# EAGLE design Tueroeffner (EAGLE 7.4.0)
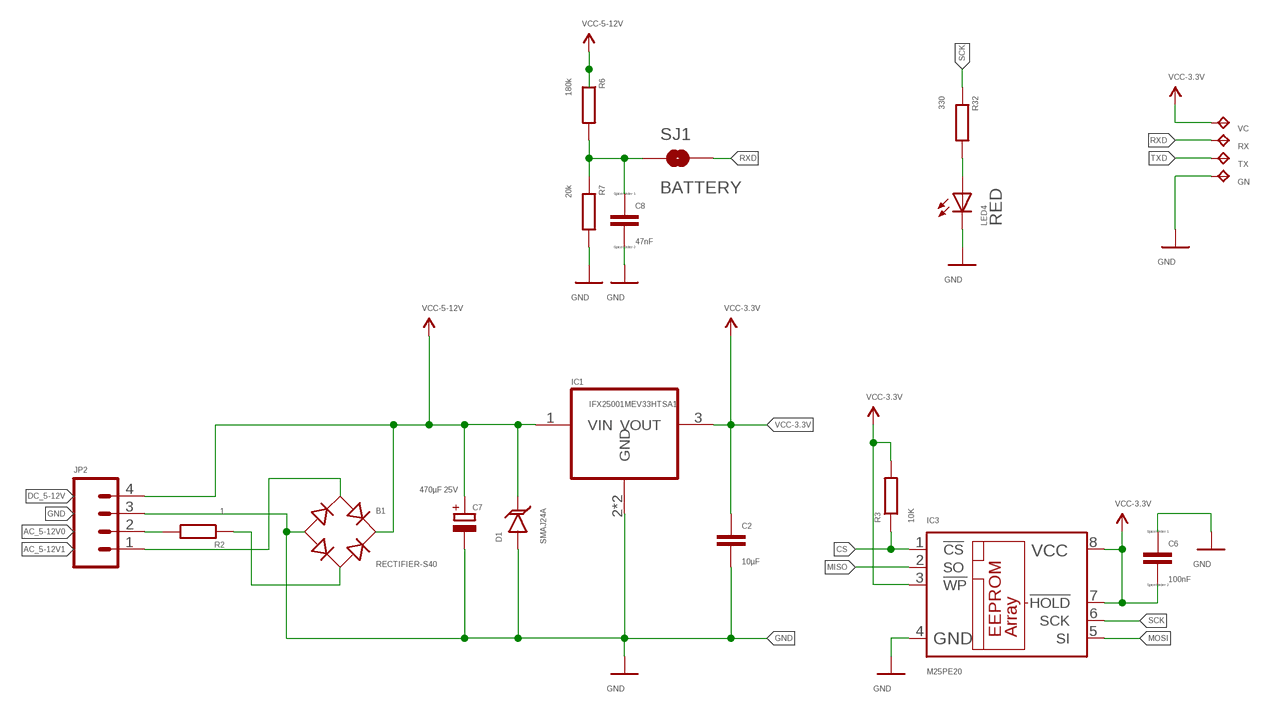
[diagram p0: schematic, sheet 1, part 1 of 2]
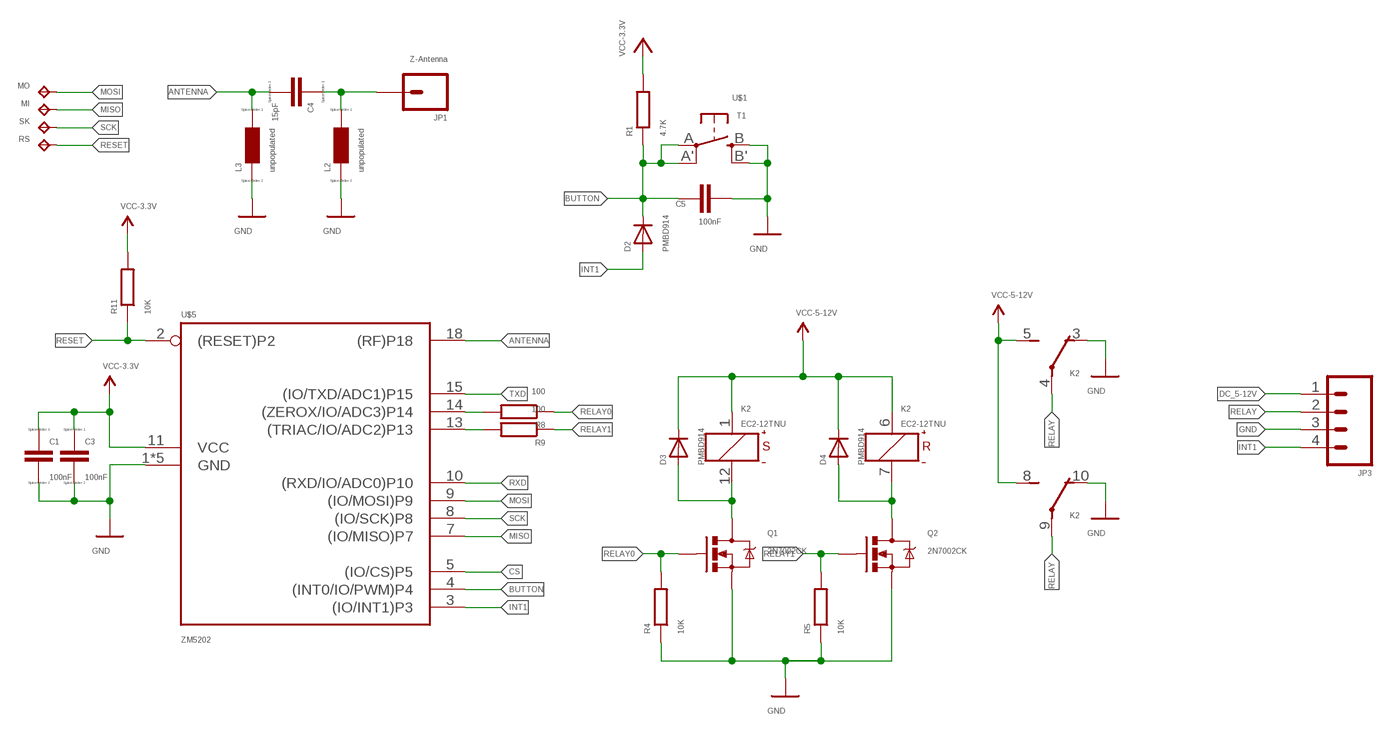
[diagram p1: schematic, sheet 1, part 2 of 2]

## Parts
B1  RECTIFIER-S40  [TO-269AA]
C1  100nF  CC2012  [C2012]
C2  10µF  C-EUC0805  [C0805]
C3  100nF  CC2012  [C2012]
C4  15pF  CC2012  [C2012]
C5  100nF  C-EUC0805  [C0805]
C6  100nF  CC2012  [C2012]
C7  470µF 25V  CPOL-EU175TMP-0810  [175TMP-0810]
C8  47nF  CC2012  [C2012]
D1  SMAJ24A  TVSSMA  [SMA-DIODE]
D2  PMBD914  D-A1-C3  [SOT23]
D3  PMBD914  D-A1-C3  [SOT23]
D4  PMBD914  D-A1-C3  [SOT23]
GN  TPTP14R  [TP14R]
IC1  IFX25001MEV33HTSA1  REG1118  [SOT223]
IC3  M25PE20  25LC080SN  [SO-08]
JP1  Z-Antenna  M01PTH  [1X01]
JP2  M04SCREW  [SCREWTERMINAL-3.5MM-4]
JP3  M04SCREW  [SCREWTERMINAL-3.5MM-4]
K2  EC2-12TNU  TX2-L2-12V  [TX2-L2]
L2  unpopulated  LL2012C  [L2012C]
L3  unpopulated  LL2012C  [L2012C]
LED4  RED  LEDCHIP-LED0805  [CHIP-LED0805]
MI  TPTP14R  [TP14R]
MO  TPTP14R  [TP14R]
Q1  2N7002CK  MOSFET-NCHANNELBSS138  [SOT23-3]
Q2  2N7002CK  MOSFET-NCHANNELBSS138  [SOT23-3]
R1  4.7K  R-EU_M0805  [M0805]
R2  1  R-EU_M2012  [M2012]
R3  10K  R-EU_M2012  [M2012]
R4  10K  R-EU_M2012  [M2012]
R5  10K  R-EU_M2012  [M2012]
R6  180k  R-EU_M2012  [M2012]
R7  20k  R-EU_M2012  [M2012]
R8  100  R-EU_M2012  [M2012]
R9  100  R-EU_M2012  [M2012]
R11  10K  R-EU_M2012  [M2012]
R32  330  R-EU_M2012  [M2012]
RS  TPTP14R  [TP14R]
RX  TPTP14R  [TP14R]
SJ1  BATTERY  SOLDERJUMPERTRACE  [SJ_2S-TRACE]
SK  TPTP14R  [TP14R]
TX  TPTP14R  [TP14R]
U$1  T1  EVQQ2  [EVQ-Q2]
U$5  ZM5202  ZM5202ZM5202_STERN  [ZM5202_STERN]
VC  TPTP14R  [TP14R]

## Nets
AC_5-12V0: JP2.2 R2.2
AC_5-12V1: B1.AC1 JP2.1
ANTENNA: C4.2 L3.1 U$5.18((RF)P18)
BUTTON: C5.1 D2.3(C) R1.1 U$1.A'(P1) U$1.A(P) U$5.4((INT0/IO/PWM)P4)
CS: IC3.1(!CS) R3.1 U$5.5((IO/CS)P5)
DC_5-12V: B1.+ C7.+ D1.C D3.3(C) D4.3(C) IC1.1(VIN) JP2.4 JP3.1 K2.1(S:+) K2.5(1:S) K2.6(R:+) K2.8(2:S) R6.1 ; supply symbol labelled VCC-5-12V
GND: B1.- C1.2 C2.2 C3.2 C5.2 C6.1 C7.- C8.2 D1.A GN.TP IC1.2(GND) IC1.4(GND) IC3.4(GND) JP2.3 JP3.3 K2.3(1:O) K2.10(2:O) L2.2 L3.2 LED4.C Q1.2(S) Q2.2(S) R4.1 R5.1 R7.2 U$1.B'(S1) U$1.B(S) U$5.1(GND) U$5.6(GND) U$5.12(GND) U$5.16(GND) U$5.17(GND)
INT1: D2.1(A) JP3.4 U$5.3((IO/INT1)P3)
MISO: IC3.2(SO) MI.TP U$5.7((IO/MISO)P7)
MOSI: IC3.5(SI) MO.TP U$5.9((IO/MOSI)P9)
N$1: B1.AC2 R2.1
N$2: C8.1 R6.2 R7.1 SJ1.1
N$4: R8.2 U$5.14((ZEROX/IO/ADC3)P14)
N$5: R9.2 U$5.13((TRIAC/IO/ADC2)P13)
N$6: D3.1(A) K2.12(S:-) Q1.3(D)
N$7: D4.1(A) K2.7(R:-) Q2.3(D)
N$28: LED4.A R32.2
N$33: C4.1 JP1.1 L2.1
RELAY: JP3.2 K2.4(1:P) K2.9(2:P)
RELAY0: Q1.1(G) R4.2 R8.1
RELAY1: Q2.1(G) R5.2 R9.1
RESET: R11.1 RS.TP U$5.2((RESET)P2)
RXD: RX.TP SJ1.2 U$5.10((RXD/IO/ADC0)P10)
SCK: IC3.6(SCK) R32.1 SK.TP U$5.8((IO/SCK)P8)
TXD: TX.TP U$5.15((IO/TXD/ADC1)P15)
VCC-3.3V: C1.1 C2.1 C3.1 C6.2 IC1.3(VOUT) IC3.3(!WP) IC3.7(!HOLD) IC3.8(VCC) R1.2 R3.2 R11.2 U$5.11(VCC) VC.TP

## Library data of the parts
B1 = rectifier:RECTIFIER-: Rectifier
C1 C3 C4 C6 C8 = eagle-ltspice:C: CAPACITOR, European symbol; SPICEMODEL: NONE; SPICEPREFIX: C
C2 C5 = rcl:C-EU: CAPACITOR, European symbol
C7 = rcl:CPOL-EU: POLARIZED CAPACITOR, European symbol
D1 = SparkFun-DiscreteSemi:TVS: Transient voltage suppressor- prevents ESD on inputs.
D2-D4 = semicon-smd-ipc:D-: DIODE unfilled
GN MI MO RS RX SK TX VC = testpad:TP: Test pad
IC1 = burr-brown:REG1118: 800mA Low Dropout (LDO) Positive Regulator with Current Source and Sink Capability; MPN: REG1118-2.85/2K5G4; OC_FARNELL: unknown; OC_NEWARK: 14M2185
IC3 = 25LC320A:25*: Serial EEPROM 4K/ 8K , SPI bus; MPN: 25LC320A
JP1 = SparkFun-Connectors:M01: Header 1 Standard 1-pin 0.1" header. Use with straight break away headers (SKU : PRT-00116), right angle break away headers (PRT-00553), swiss pins (PRT-00743), machine pins (PRT-00117), and female headers (PRT-00115).
JP2 JP3 = SparkFun-Connectors:M04: Header 4 Standard 4-pin 0.1" header. Use with straight break away headers (SKU : PRT-00116), right angle break away headers (PRT-00553), swiss pins (PRT-00743), machine pins (PRT-00117), and female headers (PRT-00115). Molex polarized connector foot print use with SKU : PRT-08231 with associated crimp pins and housings. 1MM SMD Version SKU: PRT-10208
K2 = relay:TX2?-L2-*: TX Relay 2 coil latching NAiS 2 AMP. HIGH CAPACITY RELAY WITH HIGH SURGE VOLTAGE & HIGH BREAKDOWN VOLTAGE Source: http://www.mew-europe.com/.. en_ds_61022_0001.pdf TX-S SMALL POLARIZED WITH HIGH SENSITIVITY 50mW Source: http://www.mew-europe.com/.. en_ds_61022_0022.pdf; MF: AROMAT/ MATSUSHITA; MPN: TX2-L2-12V; OC_FARNELL: 1124060; OC_NEWARK: 64K3213
L2 L3 = eagle-ltspice:L: INDUCTOR, European symbol; SPICEMODEL: NONE; SPICEPREFIX: L
LED4 = adafruit:LED: LED OSRAM: - CHIPLED LG R971, LG N971, LY N971, LG Q971, LY Q971, LO R971, LY R971 LH N974, LH R974 LS Q976, LO Q976, LY Q976 LO Q996 - Hyper CHIPLED LW Q18S LB Q993, LB Q99A, LB R99A - SideLED LS A670, LO A670, LY A670, LG A670, LP A670 LB A673, LV A673, LT A673, LW A673 LH A674 LY A675 LS A676, LA A676, LO A676, LY A676, LW A676 LS A679, LY A679, LG A679 - Hyper Micro SIDELED® LS Y876, LA Y876, LO Y876, LY Y876 LT Y87S - SmartLED LW L88C, LW L88S LB L89C, LB L89S, LG L890 LS L89K, LO L89K, LY L89K LS L896, LA L896, LO L896, LY L896 - TOPLED LS T670, LO T670, LY T670, LG T670, LP T670 LSG T670, LSP T670, LSY T670, LOP T670, LYG T670 LG T671, LOG T671, LSG T671 LB T673, LV T673, LT T673, LW T673 LH T674 LS T676, LA T676, LO T676, LY T676, LB T676, LH T676, LSB T676, LW T676 LB T67C, LV T67C, LT T67C, LS T67K, LO T67K, LY T67K, LW E67C LS E67B, LA E67B, LO E67B, LY E67B, LB E67C, LV E67C, LT E67C LW T67C LS T679, LY T679, LG T679 LS T770, LO T770, LY T770, LG T770, LP T770 LB T773, LV T773, LT T773, LW T773 LH T774 LS E675, LA E675, LY E675, LS T675 LS T776, LA T776, LO T776, LY T776, LB T776 LHGB T686 LT T68C, LB T68C - Hyper Mini TOPLED® LB M676 - Mini TOPLED Santana® LG M470 LS M47K, LO M47K, LY M47K Source: http://www.osram.convergy.de/
Q1 Q2 = SparkFun-DiscreteSemi:MOSFET-NCHANNEL: Common NMOSFET Parts MFG P/N Store ID Prod ID FDD8780 TRANS-09984 SI7820DN TRANS-11055 FDS6630A IC-08089 2N7002PW TRANS-11151 FQP30N06L COM-10213 TRANS-10060 BSS123LT1G TRANS-08345 BSS138 TRANS-00830 BS170 2N7000; PROD_ID: TRANS-00830; VALUE: 200mA/50V
R1 = rcl:R-EU_: RESISTOR, European symbol
R2-R9 R11 R32 = resistor:R-EU_: RESISTOR, European symbol
SJ1 = SparkFun:SOLDERJUMPER: Solder Jumper Standard SMD solder jumper. Used to automate production. Two varients : Normally Open and Normally Closed are the same, but have different paste layers. NC will have a large amount of paste and should jumper during reflow.
U$1 = adafruit:EVQQ2: SMT 6mm switch, EVQQ2 series http://www.ladyada.net/library/eagle
U$5 = ZM5202:ZM5202: ZM5202 Z-Wave RF-Module

## Board
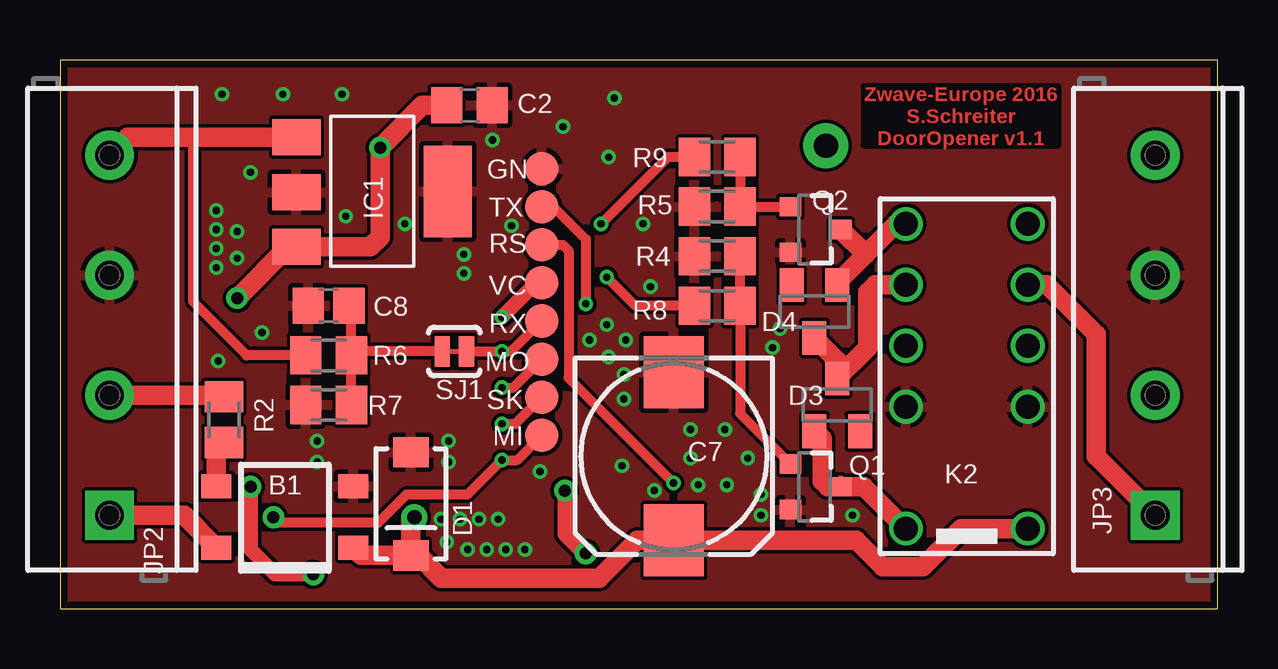
[diagram p2: board, top side]
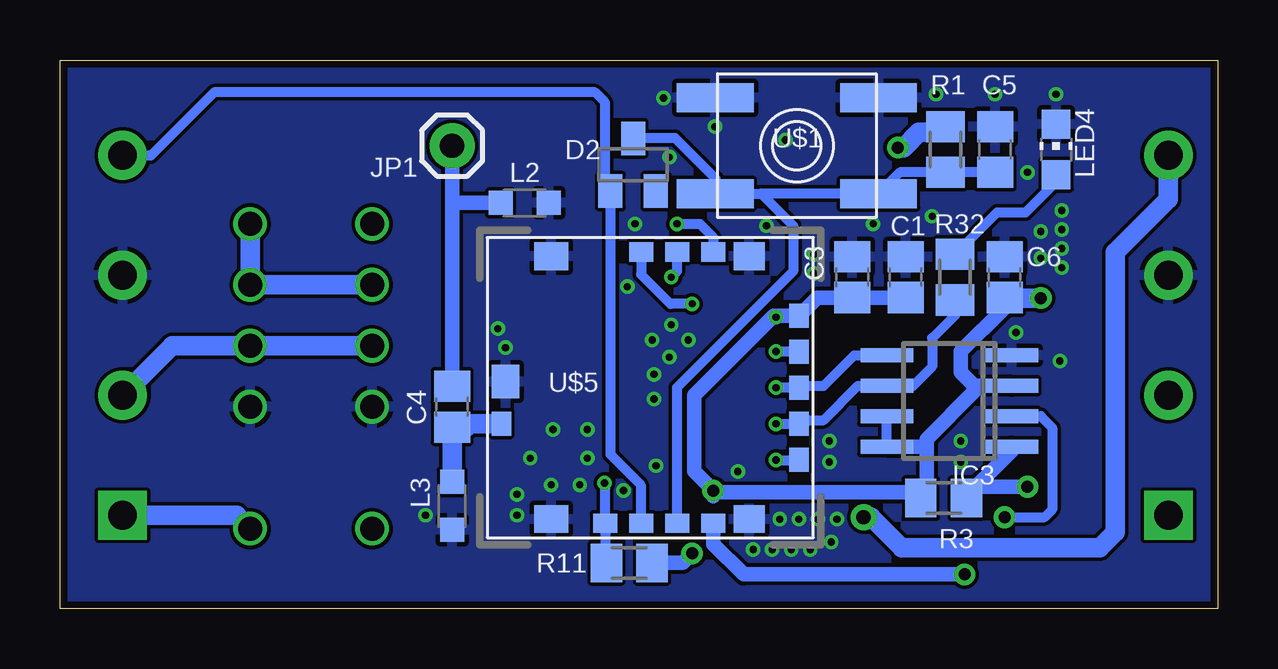
[diagram p3: board, bottom side, seen from below]

Size 48.25 x 22.86 mm. Coordinates in mm from the lower left corner, seen from the top.
Outline: 48.25,22.85 0,22.85 0,0 48.25,0 48.25,22.86
Copper layers (1*16): Top 0.035mm / dielectric 1.5mm / Bottom 0.035mm
Design rules "PCB-POOL Standard *": minimum track width 12mil, minimum drill 0.3mm, track to track 0.15mm, track to pad 0.15mm, pad to pad 0.15mm, via to via 0.15mm, smd to smd 0.15mm, copper to edge 0.3mm, drill to drill 0.2mm, minimum pad ring 0.2mm, minimum via ring 0.15mm, stop-mask expansion 0.075mm, vias tented up to drill 0mil, thermal gap 0.2mm

### Footprints (pad centres in the part's own frame; a part is rotated, then mirrored left to right if it is on the bottom)
TO-269AA = smd 1 x 1.25: + -1.28,-2.855; - 1.28,-2.855; AC1 -1.28,2.855; AC2 1.28,2.855
C2012 = smd 1.3 x 1.5: 1 -0.85,0; 2 0.85,0
C0805 = smd 1.3 x 1.5: 1 -0.95,0; 2 0.95,0
175TMP-0810 = smd 3 x 2.5: + 3.5,0; - -3.5,0
SMA-DIODE = smd 1.27 x 1.47: A -2.15,0; C 2.15,0
SOT23 = smd 1 x 1.4: 1 -0.95,-1.1; 2 0.95,-1.1; 3 0,1.1
TP14R = smd 1.4 x 1.4: TP 0,0
SOT223 = smd 1.499 x 2.007: 1 -2.261,-3.15; 2 0.025,-3.15; 3 2.311,-3.15 | smd 3.81 x 2.007: 4 0,3.15
SO-08 = smd 0.6 x 2.2: 1 -1.905,-2.6; 2 -0.635,-2.6; 3 0.635,-2.6; 4 1.905,-2.6; 5 1.905,2.6; 6 0.635,2.6; 7 -0.635,2.6; 8 -1.905,2.6
1X01 = drill 1.016 pad 1.88: 1 0,0
SCREWTERMINAL-3.5MM-4 = drill 1.2 pad 2.032 square: 1 0,0 | drill 1.2 pad 2.032: 2 5,0; 3 10,0; 4 15,0
TX2-L2 = drill 1: 1 -6.35,-2.54; 3 -1.27,-2.54; 4 1.27,-2.54; 5 3.81,-2.54; 6 6.35,-2.54; 7 6.35,2.54; 8 3.81,2.54; 9 1.27,2.54; 10 -1.27,2.54; 12 -6.35,2.54
L2012C = smd 1 x 1: 1 -1,0; 2 1,0
CHIP-LED0805 = smd 1.2 x 1.2: A 0,-1.05; C 0,1.05
SOT23-3 = smd 0.8 x 0.9: 1 -0.95,-1; 2 0.95,-1; 3 0,1.1
M0805 = smd 1.3 x 1.6: 1 -0.95,0; 2 0.95,0
M2012 = smd 1.3 x 1.6: 1 -0.95,0; 2 0.95,0
SJ_2S-TRACE = smd 0.635 x 1.27: 1 -0.508,0; 2 0.508,0
EVQ-Q2 = smd 3.2 x 1.2: A -3.4,-2; A' 3.4,-2; B -3.4,2; B' 3.4,2
ZM5202_STERN = smd 1.4 x 1.15: 1 4.125,5.475; 16 4.125,-5.475 | smd 1 x 0.8: 2 1.875,5.65; 3 0.375,5.65; 4 -1.125,5.65; 5 -2.625,5.65; 13 -2.625,-5.65; 14 -1.125,-5.65; 15 0.375,-5.65 | smd 1.3 x 1.15: 6 -4.125,5.475; 12 -4.125,-5.475 | smd 0.8 x 1: 7 -6.2,3; 8 -6.2,1.5; 9 -6.2,0; 10 -6.2,-1.5; 11 -6.2,-3; 18 6.2,1.5 | smd 1.15 x 1.4: 17 6.025,-0.25

### Placement (x,y rotation side)
B1  9.37,3.83 90 top
C1  13.02,13.81 90 bottom
C2  17.07,20.97 0 top
C3  15.24,13.81 90 bottom
C4  31.91,8.41 270 bottom
C5  9.29,19.13 90 bottom
C6  8.89,13.81 270 bottom
C7  25.57,6.35 270 top
C8  11.19,12.62 180 top
D1  14.62,4.37 270 top
D2  24.37,18.49 0 bottom
D3  32.38,8.49 0 top
D4  31.43,12.38 180 top
GN  20.08,18.34 0 top
IC1  13,17.38 270 top
IC3  11.19,8.65 90 bottom
JP1  31.91,19.29 180 bottom
JP2  2.06,3.89 90 top
JP3  45.64,3.89 90 top
K2  37.78,9.68 90 top
L2  28.89,16.91 0 bottom
L3  31.91,4.29 270 bottom
LED4  6.75,19.13 0 bottom
MI  20.08,7.22 0 top
MO  20.08,10.4 0 top
Q1  31.43,5.08 270 top
Q2  31.43,15.8 270 top
R1  11.35,19.13 90 bottom
R2  6.83,7.87 90 top
R3  11.43,4.6 180 bottom
R4  27.38,14.68 0 top
R5  27.38,16.75 0 top
R6  11.19,10.56 0 top
R7  11.19,8.49 180 top
R8  27.38,12.62 180 top
R9  27.38,18.81 180 top
R11  24.53,1.91 0 bottom
R32  10.95,13.81 90 bottom
RS  20.08,15.16 0 top
RX  20.08,11.99 0 top
SJ1  16.43,10.72 0 top
SK  20.08,8.81 0 top
TX  20.08,16.75 0 top
U$1  17.54,19.29 0 bottom
U$5  23.65,9.21 180 bottom
VC  20.08,13.57 0 top

### Tracks (layer width: path | path; a pad name or v marks a point on that pad's centre or on a via)
AC_5-12V0
  Top 0.813: JP2.2 6.65,8.89 R2.2
AC_5-12V1
  Top 0.813: JP2.1 5.17,3.89 B1.AC1
ANTENNA
  Bottom 0.813: U$5.18 31.19,7.7 31.33,7.56 C4.2 L3.1
BUTTON
  Bottom 0.406: C5.1 R1.1 13.25,18.18 U$1.A' 19.03,17.29 | D2.3 24.36,19.61 22.62,19.61 20.94,17.93 U$1.A 19.37,17.29 19.03,17.29 | 19.03,17.29 17.7,15.95 17.7,14.05 22.54,9.21 22.54,3.57 U$5.4
CS  (via drill 0.5)
  Top 0.61: v7.94,5.08 7.94,2.46 8.97,1.43 v10.56,1.43
  Bottom 0.406: 10.08,5.08 R3.1 10.16,5
  Bottom 0.61: IC3.1 8.59,6.57 10.08,5.08 v7.94,5.08 | U$5.5 21.03,2.69 19.76,1.43 v10.56,1.43
DC_5-12V  (via drill 0.6)
  Top 0.406: 5.48,19.64 5.56,19.57 5.56,12.78 7.78,10.56 R6.1
  Top 0.813: K2.5 41.12,13.49 43.18,11.43 43.18,6.35 JP3.1 | K2.8 33.97,13.49 33.66,13.18 33.66,10.87 32.37,9.59 D3.3 32.38,10.33 D4.3 | K2.1 37.54,3.33 35.96,1.75 34.29,1.75 33.19,2.85 C7.+ 24.04,2.85 22.46,1.27 15.88,1.27 14.94,2.22 D1.C | IC1.1 5.48,19.64 2.82,19.64 JP2.4 | D1.C 12.55,2.22 B1.+ | D1.C 14.62,3.67 v14.76,3.81
  Bottom 0.813: JP2.4 2.06,17.07 4.29,14.84 4.29,3.17 4.92,2.54 13.18,2.54 14.45,3.81 v14.76,3.81 | K2.8 K2.5 K2.6 | JP3.1 40.88,3.89 K2.1
GND  (via drill 0.3)
  other vias: 22.86,10.48 23.49,9.76 22.07,11.19 23.49,8.73 24.61,13.41 24.29,16.03 22.86,18.81 18.26,3.73 17.46,3.73 16.67,3.73 15.88,3.73 19.37,2.46 18.57,2.46 17.78,2.46 16.99,2.46 16.11,2.78 22.78,11.83 23.57,11.19 27.78,5.16 29.21,3.89 29.21,4.76 33.02,3.89 29.69,10.87 30,11.67 20,5.71 16.19,6.98 24.76,4.92 23.42,5.95 26.27,7.46 27.7,7.46 26.59,5.16 28.65,6.27 26.27,6.27 16.19,6.11 10.72,6.98 6.59,10.32 8.41,11.51 10.72,6.11 16.83,13.97 16.83,14.76 14.37,16.03 11.91,16.35 11.75,21.43 6.75,21.43 9.29,21.43 7.94,18.18 6.51,16.59 6.51,15.8 6.51,15 6.51,14.21 7.38,14.61 7.38,15.72 23.1,21.27 20.95,20.08 18.02,19.53 18.81,15.95
  pour Bottom: 0,0 48.58,0 48.58,22.86 0,22.86
  pour Top (rank 2): 0,0 48.58,0 48.58,22.86 0,22.86
INT1
  Bottom 0.406: U$5.3 24.05,3.58 24.05,5.16 25.32,6.43 D2.1 25.56,17.63 25.56,21.11 25.96,21.51 41.83,21.51 44.45,18.89 JP3.4
MISO  (via drill 0.3, 0.5)
  Top 0.406: v8.89,3.81 9.05,3.57 13.26,3.57 14.45,4.76 16.99,4.76 v18.42,6.19 19.05,6.19 MI.TP
  Bottom 0.406: IC3.2 7.38,8.02 6.91,7.54 6.91,4.13 7.22,3.81 v8.89,3.81 | 17.46,6.19 U$5.7 17.47,6.19 v18.42,6.19
MOSI  (via drill 0.3)
  Top 0.406: v18.42,9.21 18.89,9.21 MO.TP
  Bottom 0.406: IC3.5 15.16,10.56 16.43,9.29 17.37,9.29 U$5.9 v18.42,9.21
N$1
  Top 0.813: B1.AC2 6.51,6.85 R2.1
N$2
  Top 0.406: R7.1 R6.2 | R6.2 12.14,12.52 C8.1 | SJ1.1 12.3,10.72 R6.2
N$4  (via drill 0.3)
  Top 0.406: R8.2 23.97,12.62 v22.78,13.81
  Bottom 0.406: v22.78,13.81 22.53,14.06 U$5.14
N$5  (via drill 0.3)
  Top 0.406: R9.2 25.32,18.81 v22.54,16.03
  Bottom 0.406: v22.54,16.03 21.59,16.03 21.03,15.47 U$5.13
N$6
  Top 0.406: Q1.3 32.53,5.34
  Top 0.813: K2.12 33.5,5.08 Q1.3 31.99,5.08 31.75,5.32 31.75,7.08 D3.1
N$7
  Top 0.406: D4.1 32.38,13.58
  Top 0.813: 33.56,14.76 Q2.3 | 32.38,13.58 33.56,14.76 | 33.56,14.76 34.83,16.03 K2.7
N$28
  Bottom 0.406: R32.2 9.2,16.51 8.02,16.51 6.75,17.78 LED4.A
N$33
  Bottom 0.61: L2.1 31.91,16.91 | 31.91,16.91 31.91,16.99 JP1.1 | C4.1 31.91,16.91
RELAY
  Bottom 0.813: K2.9 K2.4 43.58,10.95 JP3.2
RELAY0
  Top 0.406: R4.2 R8.1 28.33,8.13 Q1.1
RELAY1
  Top 0.406: R9.1 R5.2 Q2.1
RESET  (via drill 0.3)
  Top 0.406: RS.TP 20.95,15.16 21.19,14.92 21.19,9.6 v25.56,5.24
  Bottom 0.406: R11.1 25.53,1.96 U$5.2 25.56,3.59 v25.56,5.24
RXD  (via drill 0.3)
  Top 0.406: RX.TP 18.81,10.72 v18.42,10.72 SJ1.2
  Bottom 0.406: v18.42,10.72 U$5.10
SCK  (via drill 0.3)
  Top 0.406: v18.42,7.7 18.97,7.7 SK.TP
  Bottom 0.406: v18.42,7.7 U$5.8 17.3,7.86 16.43,7.86 15,9.29 IC3.6 12.7,9.29 11.91,10.08 11.91,11.27 10.95,12.22 R32.1
TXD  (via drill 0.3)
  Top 0.406: TX.TP 20.56,16.75 21.91,15.4 v21.91,12.7
  Bottom 0.406: U$5.15 24.03,13.91 22.82,12.7 v21.91,12.7
VCC-3.3V  (via drill 0.3, 0.5)
  Top 0.406: v21.91,2.3 21.83,2.3
  Top 0.61: VC.TP 19.84,13.57 v18.42,12.14 | v21.03,4.92 21.03,3.1 21.83,2.3
  Top 0.813: v7.38,12.94 9.52,15.07 IC1.3 12.93,15.07 13.34,15.48 v13.34,19.21 15.1,20.97 C2.1
  Bottom 0.406: IC3.8 IC3.7 | 18.42,12.21 18.51,12.21 | v21.03,4.92 21.03,4.68 | 12.14,4.84 R3.2
  Bottom 0.61: IC3.3 10.16,9.29 | 20.95,4.84 12.22,4.84 R3.2 | 18.51,12.21 21.83,8.89 21.83,5.71 20.95,4.84 | 21.03,4.68 20.95,4.84 | v18.42,12.14 18.42,12.21 U$5.11 16.7,12.96 C3.1 C1.1 | R11.2 22.3,1.91 v21.91,2.3 | 12.14,6.75 12.14,7.07 10.16,9.05 10.16,9.29 | 12.14,6.75 12.14,4.84 | 10.16,9.29 10.72,9.84 10.72,10.72 8.89,12.54 C6.2 | IC3.8 12.14,6.75
  Bottom 0.813: C6.2 8.87,12.94 v7.38,12.94 | R1.2 11.59,19.84 12.46,19.84 13.1,19.21 v13.34,19.21

### Text on the board
Top: Zwave-Europe 2016 / S.Schreiter / DoorOpener v1.1